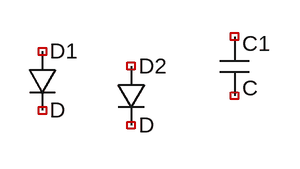
[diagram p0: schematic spice.asc]
spice.asc, the LTspice schematic file:
Version 4
SHEET 1 880 680
SYMBOL diode 16 80 R0
SYMATTR InstName D1
SYMBOL diode 112 96 R0
SYMATTR InstName D2
SYMBOL cap 224 64 R0
SYMATTR InstName C1

The netlist it stands for:
* spice.asc
D1 NC_01 NC_02 D
D2 NC_03 NC_04 D
C1 NC_05 NC_06 C
.model D D
.lib standard.dio
.backanno
.end